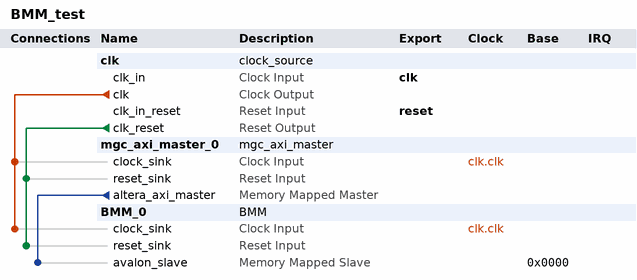
[diagram p0: system contents]
# Platform Designer (Qsys) system BMM_test, Cyclone V Unknown
# Parameters at their usual value, and those the tool derives, are not listed.
package require -exact qsys 17.0
create_system BMM_test
set_project_property DEVICE_FAMILY {Cyclone V}
set_project_property DEVICE Unknown

add_instance clk clock_source 17.0
set_instance_parameter_value clk clockFrequency 50000000
set_instance_parameter_value clk resetSynchronousEdges DEASSERT

add_instance mgc_axi_master_0 mgc_axi_master 10.4.3.0
set_instance_parameter_value mgc_axi_master_0 AXI_ADDRESS_WIDTH 30
set_instance_parameter_value mgc_axi_master_0 AXI_ID_WIDTH 12
set_instance_parameter_value mgc_axi_master_0 AXI_RDATA_WIDTH 128
set_instance_parameter_value mgc_axi_master_0 AXI_WDATA_WIDTH 128
set_instance_parameter_value mgc_axi_master_0 COMBINED_ISSUING_CAPABILITY 16
set_instance_parameter_value mgc_axi_master_0 READ_ISSUING_CAPABILITY 16
set_instance_parameter_value mgc_axi_master_0 WRITE_ISSUING_CAPABILITY 16
set_instance_parameter_value mgc_axi_master_0 index 0

add_instance BMM_0 BMM 1.0

# connections
add_connection clk.clk BMM_0.clock_sink clock
add_connection clk.clk mgc_axi_master_0.clock_sink clock
add_connection clk.clk_reset BMM_0.reset_sink reset
add_connection clk.clk_reset mgc_axi_master_0.reset_sink reset
add_connection mgc_axi_master_0.altera_axi_master BMM_0.avalon_slave avalon
set_connection_parameter_value mgc_axi_master_0.altera_axi_master/BMM_0.avalon_slave baseAddress 0x0000

# exported interfaces
add_interface clk clock sink
set_interface_property clk EXPORT_OF clk.clk_in
add_interface reset reset sink
set_interface_property reset EXPORT_OF clk.clk_in_reset

set_interconnect_requirement {$system} qsys_mm.clockCrossingAdapter HANDSHAKE
set_interconnect_requirement {$system} qsys_mm.insertDefaultSlave FALSE
set_interconnect_requirement {$system} qsys_mm.maxAdditionalLatency 1

save_system BMM_test.qsys
